# EAGLE design minesp (EAGLE 8.3.2)
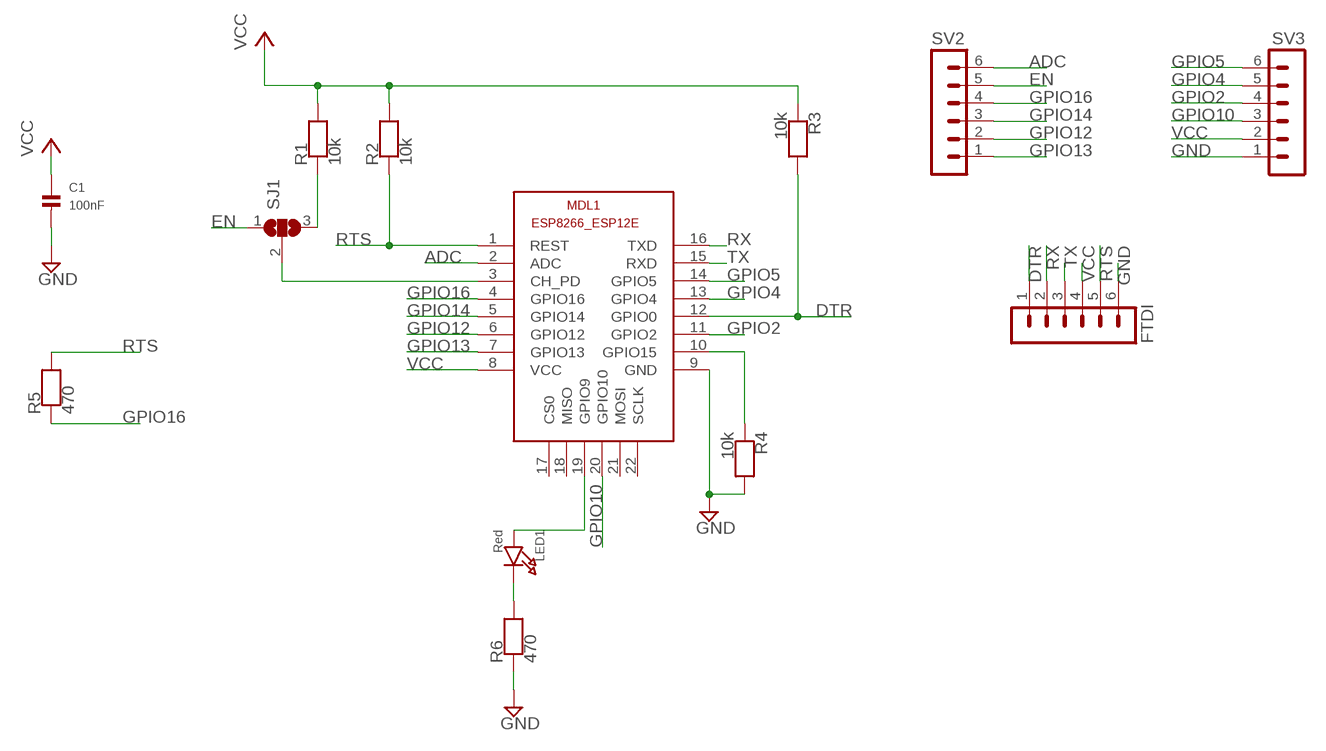
[diagram p0: schematic, sheet 1]

## Parts
C1  100nF  CAP_CERAMIC0805  [0805]
FTDI  MA06-1  [MA06-1]
LED1  Red  LED0805  [CHIPLED_0805]
MDL1  ESP8266-12EESP8266-ESP12E  [ESP8266-ESP12E]
R1  10k  RESISTOR0805  [0805]
R2  10k  RESISTOR0805  [0805]
R3  10k  RESISTOR0805  [0805]
R4  10k  RESISTOR0805  [0805]
R5  470  RESISTOR0805  [0805]
R6  470  RESISTOR0805  [0805]
SJ1  SJ2W  [SJ_2]
SV2  MA06-1  [MA06-1]
SV3  MA06-1  [MA06-1]

## Nets
ADC: MDL1.2(ADC) SV2.6
DTR: FTDI.1 MDL1.12(GPIO0) R3.2
EN: SJ1.1 SV2.5
GND: C1.2 FTDI.6 MDL1.9(GND) R4.2 R6.1 SV3.1
GPIO2: MDL1.11(GPIO2) SV3.4
GPIO4: MDL1.13(GPIO4) SV3.5
GPIO5: MDL1.14(GPIO5) SV3.6
GPIO10: MDL1.20(GPIO10) SV3.3
GPIO12: MDL1.6(GPIO12) SV2.2
GPIO13: MDL1.7(GPIO13) SV2.1
GPIO14: MDL1.5(GPIO14) SV2.3
GPIO16: MDL1.4(GPIO16) R5.1 SV2.4
N$1: LED1.A MDL1.19(GPIO9)
N$2: MDL1.3(CH_PD) SJ1.2
N$3: LED1.C R6.2
N$6: MDL1.10(GPIO15) R4.1
N$11: R1.1 SJ1.3
RTS: FTDI.5 MDL1.1(REST) R2.1 R5.2
RX: FTDI.2 MDL1.16(TXD)
TX: FTDI.3 MDL1.15(RXD)
VCC: C1.1 FTDI.4 MDL1.8(VCC) R1.2 R2.2 R3.1 SV3.2
Unconnected: MDL1.17(CS0) MDL1.18(MISO) MDL1.21(MOSI) MDL1.22(SCLK)

## Library data of the parts
C1 = microbuilder:CAP_CERAMIC: Ceramic Capacitors 0402 - 0402 Surface Mount Capacitors 16pF 50V 5% [Digikey: 445-4899-2-ND] 18pF 50V 5% [Digikey: 490-1281-2-ND] 22pF 50V 5% [Digikey: 490-1283-2-ND] 68pF 50V 5% [Digikey: 490-1289-2-ND] 0.1uF 10V 10% [Digikey: 490-1318-2-ND] 1.0uF 6.3V 10% [Digikey: 490-1320-2-ND] 0603 - 0603 Surface Mount Capacitors 16 pF 50V 5% [Digikey: 445-5051-2-ND] 22 pF 50V [Digikey: PCC220ACVTR-ND] 33 pF 50V 5% [Digikey: 490-1415-1-ND] 56pF 50V 5% [Digikey: 490-1421-1-ND] 220pF 50V 5% [Digikey: 445-1285-1-ND] 680 pF 50V 2200 pF 50V 5% C0G [Digikey: 445-1297-1-ND] 5600 pF 100V 5% X7R [Digikey: 478-3711-1-ND] 0.1 µF 25V 10% [Digikey: PCC2277TR-ND] 0.22 µF 16V 10% X7R [Digikey: 445-1318-1-ND] 1.0 µF 25V 10% [Digikey: 445-5146-2-ND] 0603 - RF Specific 3pF 250V +/-0.1pF RF [Digikey: 712-1347-1-ND] 18 pF 250V 5% [Digikey: 478-3505-1-ND or 712-1322-1-ND] 56 pF 250V 5% C0G RF [Digikey: 490-4867-1-ND] 68 pF 250V RF [Digikey: 490-4868-1-ND] 0805 - 0805 Surface Mount Capacitors 220 pF 250V 2% RF Ceramic Capacitor [Digikey: 712-1398-1-ND] 1000 pF 50V 2% NP0 Ceramic Capacitor [Digikey: 478-3760-1-ND] 0.1 µF 25V 10% Ceramic Capacitor [Digikey: PCC1828TR-ND] 1.0 µF 16V 10% Ceramic Capacitor[Digikey: 490-1691-2-ND] 10.0 µF 10V 10% Ceramic Capacitor[Digikey: 709-1228-1-ND] 10.0 uF 16V 10% Ceramic Capacitor [Digikey: 478-5165-2-ND] 47 uF 6.3V 20% Ceramic Capacitor [Digikey: 587-1779-1-ND or 399-5506-1-ND] 1206 - 1206 Surface Mount Capacitors 47uF 10V 20% Ceramic Capacitor [Digikey: 490-5528-1-ND or 399-5508-1-ND or 445-6010-1-ND]
FTDI SV2 SV3 = con-lstb:MA06-1: PIN HEADER; OC_FARNELL: unknown; OC_NEWARK: unknown
LED1 = microbuilder:LED: LED 0603 - 0603 Surface Mount Package 2mA: Green LED - Low Power (3.9mcd, 2ma, 1.7Vf) - Digikey: 475-2709-2-ND Orange LED - Low Power (9.8mcd, 2ma, 1.8Vf) - Digikey: 475-1194-2-ND Red LED - Low Power (5mcd, 2ma, 1.8Vf) - Digikey: 475-1195-2-ND Yellow LED - Low Power (7mcd, 2ma, 1.8Vf) - Digikey: 475-1196-2-ND 5mA: Blue LED - Low Power (17mcd, 5ma, 2.9Vf) - Digikey: LNJ937W8CRACT-ND 0805 - 0805 Surface Mount Package 2mA: Red LED (8.8mcd, 2mA, 1.8Vf, Clear) - Low Power [Digikey: 475-2510-1-ND] Green LED (5mcd, 2mA, 1.8Vf, Clear) - Low Power [Digikey: 475-2730-1-ND] Yellow LED (11.3mcd, 2mA, 1.8Vf, Clear) - Low Power [Digikey: 475-2555-1-ND] 20mA: Red LED (104mcd, 20mA, Diffused) - LS R976 [Digikey: 475-1278-6-ND] Red LED (12mcd, 20mA, 2.0Vf, Clear) - APT2012EC [Digikey: 754-1128-1-ND] Green LED (15mcd, 20mA, 2.2Vf, Clear) - APT2012GC [Digikey: 754-1131-1-ND] Orange LED (160mcd, 20mA, 2.1Vf, Clear) - APT2012SECK [Digikey: 754-1130-1-ND] 1206 - 1206 Surface Mount Package Green LED (26mcd, 20mA, Diffused) - LG N971 [Digikey: 475-1407-6-ND] Red LED (15mcd, 20mA, Diffused) - LH N974 [Digikey: 475-1416-6-ND]
MDL1 = ESP8266-ESP12E:ESP8266-12E: ESP8266-12E with additional I/O and GPIO04/05 corrected The author cannot warrant that this library is free from error or will meet your specific requirements. Created by PuceBaboon.com. Komagane, Nagano, JAPAN
R1-R6 = microbuilder:RESISTOR: Resistors 0402 - 0402 Surface Mount Package 22 Ohm 1% 1/16W [Digikey: 311-22.0LRTR-ND] 33 Ohm 5% 1/16W 1.0K 5% 1/16W 1.5K 5% 1/16W 2.0K 1% 1/16W 10.0K 1% 1/16W [Digikey: 311-10.0KLRTR-ND] 10.0K 5% 1/16W [Digikey: RMCF0402JT10K0TR-ND] 12.1K 1% 1/16W [Digikey: 311-22.0LRTR-ND] 100.0K 5% 1/16W 0603 - 0603 Surface Mount Package 0 Ohm 1/10 Watt 1% Resistor 15 Ohm 1/10 Watt 1% Resistor 33 Ohm 1/10 Watt 1% Resistor 49.9 Ohm 1/10 Watt 1% Resistor 100 Ohm 1/10 Watt 1% Resistor 150 Ohm 1/10 Watt 1% Resistor 240 Ohm 1/10 Watt 1% Resistor 390 Ohm 1/10 Watt 1% Resistor 560 Ohm 1/10 Watt 1% Resistor 680 Ohm 1/10 Watt 1% Resistor 750 Ohm 1/10 Watt 1% Resistor 1.0K Ohm 1/10 Watt 1% Resistor 1.5K Ohm 1/10 Watt 1% Resistor 2.0K Ohm 1/10 Watt 1% Resistor 2.2K Ohm 1/10 Watt 1% Resistor 3.3K Ohm 1/10 Watt 1% Resistor 4.7K Ohm 1/10 Watt 1% Resistor 10.0K Ohm 1/10 Watt 1% Resistor 12.0K Ohm 1/10 Watt 1% Resistor 12.1K Ohm 1/10 Watt 1% Resistor 20.0K Ohm 1/10 Watt 1% Resistor 33.0K Ohm 1/10 Watt 1% Resistor 100.0K Ohm 1/10 Watt 1% Resistor 0805 - 0805 Surface Mount Package 0 Ohm 1/8 Watt 1% Resistor 33 Ohm 1/8 Watt 1% Resistor 100 Ohm 1/8 Watt 1% Resistor 150 Ohm 1/8 Watt 1% Resistor 200 Ohm 1/8 Watt 1% Resistor 240 Ohm 1/8 Watt 1% Resistor 330 Ohm 1/8 Watt 1% Resistor 390 Ohm 1/8 Watt 1% Resistor 470 Ohm 1/8 Watt 1% Resistor 1.0K Ohm 1/8 Watt 1% Resistor 1.5K Ohm 1/8 Watt 1% Resistor 2.0K Ohm 1/8 Watt 1% Resistor 4.7K Ohm 1/8 Watt 1% Resistor 5.1K Ohm 1/8 Watt 1% Resistor 5.6K Ohm 1/8 Watt 1% Resistor 10.0K Ohm 1/8 Watt 1% Resistor 22.0K Ohm 1/8 Watt 1% Resistor 33.0K Ohm 1/8 Watt 1% Resistor 100K Ohm 1/8 Watt 1% Resistor 1206 - 1206 Surface Mount Package 2012 - 2010 Surface Mount Package 0.11 Ohm 1/2 Watt 1% Resistor - Digikey: RHM.11UCT-ND
SJ1 = jumper:SJ2W: SMD solder JUMPER

## Board
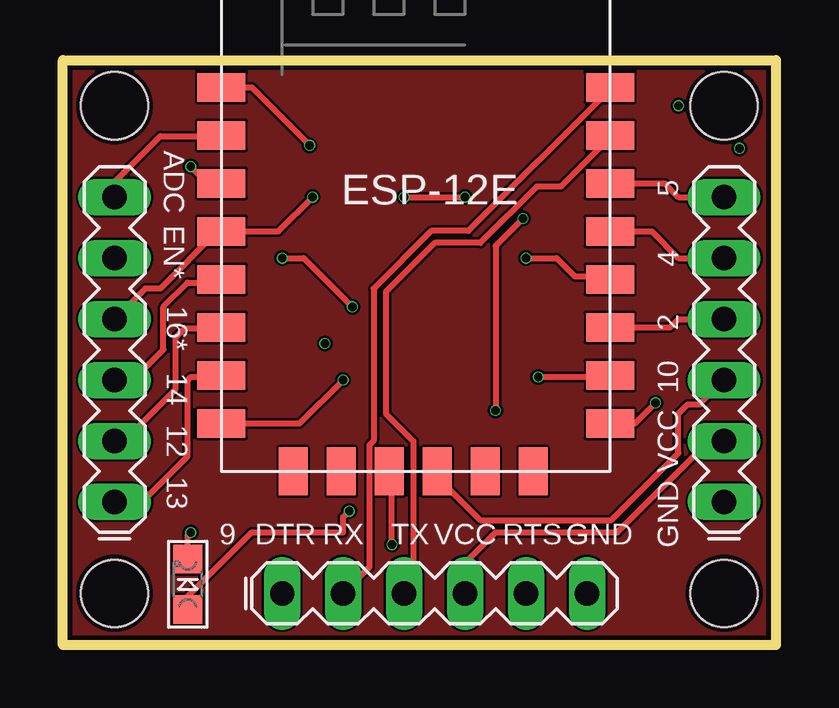
[diagram p1: board, top side]
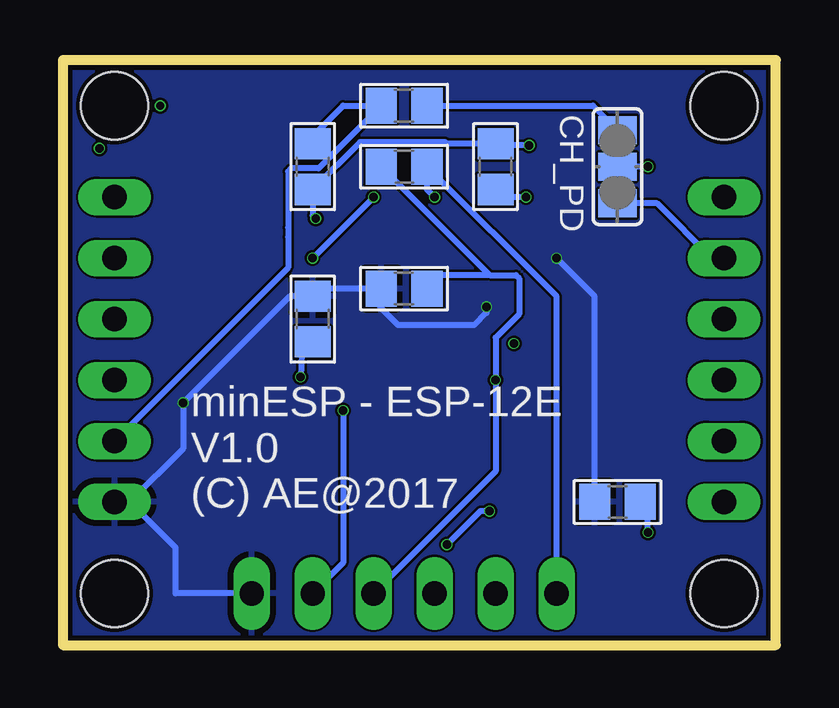
[diagram p2: board, bottom side, seen from below]

Size 29.72 x 24.38 mm. Coordinates in mm from the lower left corner, seen from the top.
Outline: 0,24.38 29.72,24.38 29.72,0 0,0 0,24.38
Copper layers (1*16): Top 0.035mm / dielectric 1.5mm / Bottom 0.035mm
Design rules "aisler_go_2layer": minimum track width 0.1mm, minimum drill 0.2mm, track to track 0.1mm, track to pad 0.1mm, pad to pad 0.1mm, via to via 0.1mm, smd to smd 0.1mm, copper to edge 0.2mm, drill to drill 0.21mm, minimum pad ring 0.25mm, minimum via ring 0.05mm, stop-mask expansion 0.01mm, vias tented up to drill 0mil, thermal gap 10mil
Holes 2.8 mm at 2.16,22.48 27.56,22.48 2.16,2.16 27.56,2.16

### Footprints (pad centres in the part's own frame; a part is rotated, then mirrored left to right if it is on the bottom)
0805 = smd 1.3 x 1.5: 1 -0.95,0; 2 0.95,0
MA06-1 = drill 1.016 long: 1 -6.35,0; 2 -3.81,0; 3 -1.27,0; 4 1.27,0; 5 3.81,0; 6 6.35,0
CHIPLED_0805 = smd 1.2 x 1.2: A 0,-1.05; C 0,1.05
ESP8266-ESP12E = smd 2 x 1.2: 1 -7.62,5.84; 2 -7.62,3.84; 3 -7.62,1.84; 4 -7.62,-0.16; 5 -7.62,-2.16; 6 -7.62,-4.16; 7 -7.62,-6.16; 8 -7.62,-8.16; 9 8.58,-8.16; 10 8.58,-6.16; 11 8.58,-4.16; 12 8.58,-2.16; 13 8.58,-0.16; 14 8.58,1.84; 15 8.58,3.84; 16 8.58,5.84 | smd 1.2 x 2: 17 -4.62,-10.16; 18 -2.62,-10.16; 19 -0.62,-10.16; 20 1.38,-10.16; 21 3.38,-10.16; 22 5.38,-10.16
SJ_2 = smd 1.168 x 1.6: 1 -1.524,0; 2 0,0; 3 1.524,0

### Placement (x,y rotation side)
C1  15.49,14.86 180 bottom
FTDI  15.49,2.16 0 top
LED1  5.21,2.54 0 top
MDL1  14.22,17.4 0 top
R1  15.49,22.48 180 bottom
R2  19.3,19.94 90 bottom
R3  15.49,19.94 0 bottom
R4  19.3,13.59 90 bottom
R5  11.68,19.94 90 bottom
R6  6.6,5.97 0 bottom
SJ1  6.6,19.94 90 bottom
SV2  2.16,12.32 90 top
SV3  27.56,12.32 90 top

### Tracks (layer width: path | path; a pad name or v marks a point on that pad's centre or on a via)
ADC
  Top 0.254: SV2.6 2.16,19.3 4.06,21.21 6.57,21.21 MDL1.2
DTR  (via drill 0.35)
  Top 0.254: v14.22,18.67 v16.76,18.67 | v19.3,16.13 20.57,16.13 21.34,15.37 22.68,15.37 MDL1.12
  Bottom 0.254: FTDI.1 9.14,14.54 R3.2 14.54,18.99 v14.22,18.67 | v16.76,18.67 v19.3,16.13
EN
  Bottom 0.254: SV2.5 2.67,16.13 4.95,18.42 SJ1.1
GND  (via drill 0.35)
  Top 0.254: MDL1.9 23.84,9.24 v24.7,10.1 | v9.14,16.13 10.03,16.13 v12.06,14.1
  Bottom 0.254: FTDI.6 25.02,2.16 25.02,4.06 26.92,5.97 | 26.92,5.97 24.7,8.19 v24.7,10.1 20.26,14.54 R4.2 18.98,14.86 C1.2 16.51,14.79 16.51,14.1 15.75,13.34 12.57,13.34 12.06,13.84 v12.06,14.1 | 26.92,5.97 SV3.1 | R6.1 7.55,14.54 v9.14,16.13
  pour Bottom: 0.25,24.13 29.46,24.13 29.46,0.25 0.25,0.25
GPIO2
  Top 0.254: MDL1.11 25.3,13.24 25.65,13.59 SV3.4
GPIO4
  Top 0.254: MDL1.13 24.54,17.24 25.65,16.13 SV3.5
GPIO5
  Top 0.254: MDL1.14 25.08,19.24 25.65,18.67 SV3.6
GPIO10
  Top 0.254: MDL1.20 15.6,7 17.4,5.21 22.86,5.21 25.65,8 25.65,9.65 26.04,10.03 26.54,10.03 SV3.3
GPIO12
  Top 0.254: SV2.2 2.54,8.51 4.7,10.67 4.7,12.83 5.08,13.21 6.57,13.21 MDL1.6
GPIO13
  Top 0.254: 6.48,11.24 MDL1.7 | 6.48,11.24 6.16,11.24 | SV2.1 3.3,5.97 5.21,7.87 5.21,11.05 5.33,11.18 6.41,11.18 6.48,11.24
GPIO14
  Top 0.254: 5.71,15.24 MDL1.5 6.48,15.11 5.21,15.11 4.19,14.1 4.19,12.32 2.92,11.05 SV2.3
GPIO16  (via drill 0.35)
  Top 0.254: 6.57,17.27 MDL1.4 | MDL1.4 8.98,17.24 v10.41,18.67 | MDL1.4 6.44,17.24 4.06,14.86 3.43,14.86 SV2.4
  Bottom 0.254: v10.41,18.67 11.36,18.67 R5.1
N$1  (via drill 0.35)
  Top 0.254: LED1.A 5.21,2.03 7.87,4.7 11.68,4.7 11.68,5.33 v11.94,5.59 | v13.72,4.19 13.72,7.13 MDL1.19
  Bottom 0.254: v11.94,5.59 12.32,5.59 v13.72,4.19
N$2  (via drill 0.35)
  Top 0.254: MDL1.3 6.03,19.24 v5.33,19.94
  Bottom 0.254: v5.33,19.94 SJ1.2 6.6,21.34
N$3  (via drill 0.35)
  Top 0.254: LED1.C 5.21,4.57 v5.33,4.7
  Bottom 0.254: v5.33,4.7 5.33,5.65 R6.2
N$4
  pour Top: 0.25,24.13 29.46,24.13 29.46,0.25 0.25,0.25
N$5  (via drill 0.35)
  other vias: 25.65,22.48
N$6  (via drill 0.35)
  Top 0.254: v19.81,11.18 22.74,11.18 MDL1.10
  Bottom 0.254: R4.1 19.75,12.64 v19.81,11.18
N$7  (via drill 0.35)
  other vias: 28.19,20.7
N$8  (via drill 0.35)
  other vias: 10.92,12.57
N$11
  Bottom 0.254: SJ1.3 7.62,22.48 R1.1
RTS  (via drill 0.35)
  Top 0.254: MDL1.1 7.88,23.24 v10.29,20.83 | v19.18,17.78 18.03,16.64 v18.03,9.78
  Bottom 0.254: v10.29,20.83 11.62,20.83 R5.2 13.72,20.89 13.8,20.97 17.33,20.97 R2.1 19.3,17.91 v19.18,17.78 | v18.03,9.78 18.03,3.43 FTDI.5
RX
  Top 0.254: MDL1.16 22.8,23.16 16.9,17.26 15.35,17.26 12.95,14.86 12.95,8.51 12.78,8.33 12.78,3.25 FTDI.2
TX
  Top 0.254: MDL1.15 22.8,21.16 20.76,19.11 19.75,19.11 17.4,16.76 15.49,16.76 13.46,14.73 13.46,9.65 14.6,8.51 14.6,2.54 FTDI.3
VCC  (via drill 0.35)
  Top 0.254: FTDI.4 16.76,3.43 18.03,4.7 23.11,4.7 26.92,8.51 SV3.2 | MDL1.8 9.87,9.24 v11.68,11.05
  Bottom 0.254: R2.2 19.3,21.21 18.03,22.48 R1.2 19.06,19.87 20.2,19.87 20.33,19.73 20.33,17.4 20.33,17.01 20.33,15.74 SV3.2 | R3.1 11.92,15.42 | 11.92,15.42 10.84,15.42 10.71,15.28 10.71,13.8 11.68,12.82 v11.68,11.05 11.68,7.24 FTDI.4 | 11.92,15.42 13.99,15.42 C1.1

### Text on the board
tPlace: ADC | 5 | EN* | 4 | 2 | 16* | 14 | 10 | 12 | VCC | 13 | GND | 9 | DTR | RX | TX | VCC | RTS | GND
bNames: CH_PD | minESP - ESP-12E / V1.0 / (C) AE@2017